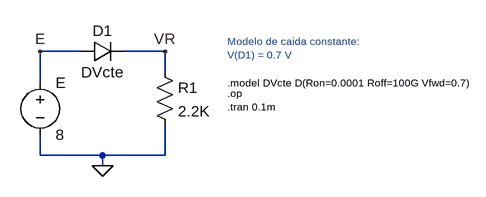
[diagram p0: schematic ejemplo1_caida-constante.asc]
ejemplo1_caida-constante.asc, the LTspice schematic file:
Version 4
SHEET 1 1376 680
WIRE -80 32 -144 32
WIRE 48 32 -16 32
WIRE 48 64 48 32
WIRE -144 80 -144 32
WIRE -144 192 -144 160
WIRE -48 192 -144 192
WIRE 48 192 48 144
WIRE 48 192 -48 192
WIRE -48 208 -48 192
FLAG -48 208 0
FLAG 48 32 VR
FLAG -144 32 E
SYMBOL diode -80 48 R270
WINDOW 0 32 32 VTop 2
WINDOW 3 0 32 VBottom 2
SYMATTR InstName D1
SYMATTR Value DVcte
SYMBOL voltage -144 64 R0
WINDOW 123 0 0 Left 0
WINDOW 39 0 0 Left 0
SYMATTR InstName E
SYMATTR Value 8
SYMBOL res 32 48 R0
SYMATTR InstName R1
SYMATTR Value 2.2K
TEXT 144 96 Left 1 !.op\n.tran 0.1m
TEXT 144 80 Left 1 !.model DVcte D(Ron=0.0001 Roff=100G Vfwd=0.7)
TEXT 144 16 Left 1 ;Modelo de caida constante:\nV(D1) = 0.7 V

The netlist it stands for:
* ejemplo1_caida-constante.asc
D1 E VR DVcte
V§E E 0 8
R1 VR 0 2.2K
.model D D
.lib standard.dio
.op
.tran 0.1m
.model DVcte D(Ron=0.0001 Roff=100G Vfwd=0.7)
* Modelo de caida constante:
* V(D1) = 0.7 V
.backanno
.end